# Altium schematic sheet EEPROM.SchDoc
size A3; SheetNumber: 12; SheetTotal: 23
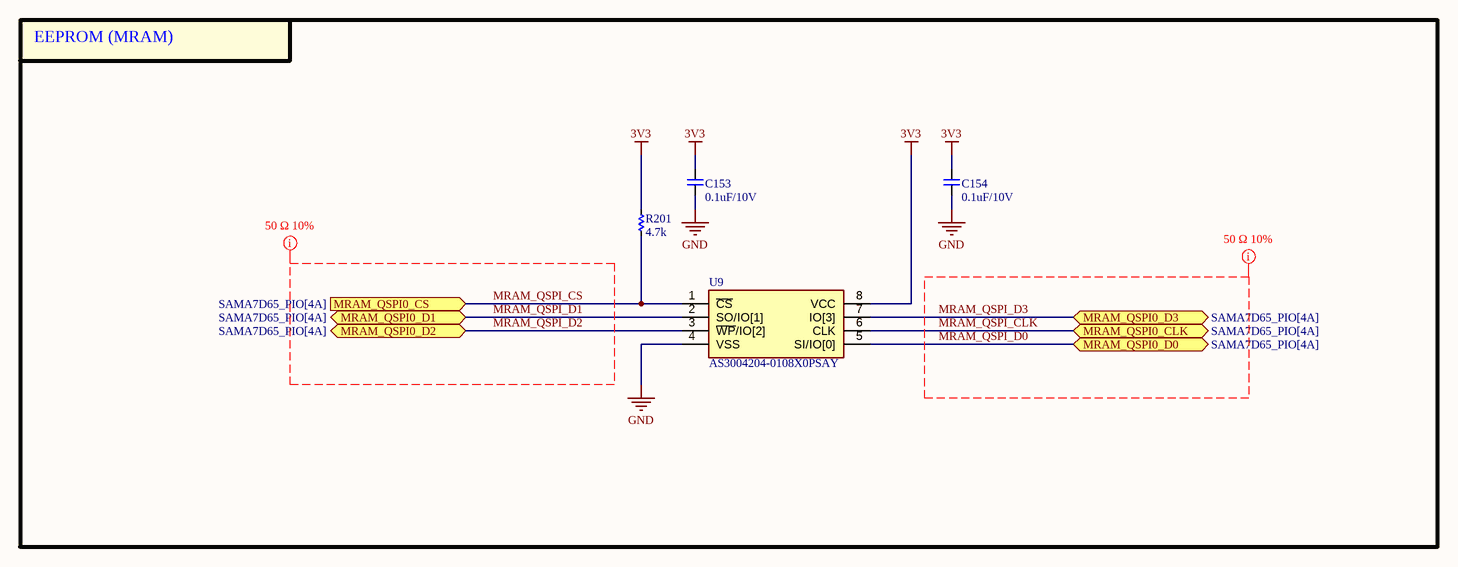
[diagram p0: EEPROM.SchDoc]

## Parts
C153  0.1uF/10V  [CAP_C_1005X50_L]
C154  0.1uF/10V  [CAP_C_1005X50_L]
R201  4.7k  [RES_C_1005x30_L]
U9  AS3004204-0108X0PSAY  [SOIC127P790X216-8N]

## Blocks framed on the sheet
EEPROM (MRAM): C153 C154 R201 U9

## Ports
MRAM_QSPI0_CLK (bidir, see SAMA7D65_PIO[4A]), MRAM_QSPI0_CS (in, see SAMA7D65_PIO[4A]), MRAM_QSPI0_D0 (bidir, see SAMA7D65_PIO[4A]), MRAM_QSPI0_D1 (bidir, see SAMA7D65_PIO[4A]), MRAM_QSPI0_D2 (bidir, see SAMA7D65_PIO[4A]), MRAM_QSPI0_D3 (bidir, see SAMA7D65_PIO[4A])

## Nets
3V3: C153.2 C154.2 R201.1 U9.8(VCC)
GND: C153.1 C154.1 U9.4(VSS)
MRAM_QSPI_CLK: U9.6(CLK) ; port MRAM_QSPI0_CLK
MRAM_QSPI_CS: R201.2 U9.1(~{CS}) ; port MRAM_QSPI0_CS
MRAM_QSPI_D0: U9.5(SI/IO[0]) ; port MRAM_QSPI0_D0
MRAM_QSPI_D1: U9.2(SO/IO[1]) ; port MRAM_QSPI0_D1
MRAM_QSPI_D2: U9.3(~{WP}/IO[2]) ; port MRAM_QSPI0_D2
MRAM_QSPI_D3: U9.7(IO[3]) ; port MRAM_QSPI0_D3

## Layout directives
net class QSPI: MRAM_QSPI_CLK, MRAM_QSPI_CS, MRAM_QSPI_D0, MRAM_QSPI_D1, MRAM_QSPI_D2, MRAM_QSPI_D3

## Notes on the sheet
- Project:
- Page Contents:
- Revision:
- Design:
- Date:
- Size:
- A3
- Document Number:
- Sheet:
- of

## Library data of the parts
C153 C154 = _CAP_C_2: CAP CHIP
R201 = _RES_B_2: RES
U9 = AS3004204-0108X0PSAY: MRAM Avalanche High Performance Serial P-SRAM 4Mb in SOIC8 package with QSPI - 108MHz interface, 3V, -40 C to 105 C; Manufacturer_Name: Avalanche Technology; Geometry.Height: 2.16mm; Manufacturer_Part_Number: AS3004204-0108X0PSAY; Mouser Part Number: 793-30042040108X0PSY; Mouser Price/Stock: https://www.mouser.co.uk/ProductDetail/Avalanche-Technology/AS3004204-0108X0PSAY/?qs=eP2BKZSCXI7G0ggegRejGg%3D%3D; Arrow Part Number: *; Arrow Price/Stock: *; Datasheet Link: https://www.mouser.ph/ProductDetail/Avalanche-Technology/AS3004204-0108X0PSAY?qs=eP2BKZSCXI7G0ggegRejGg%3D%3D